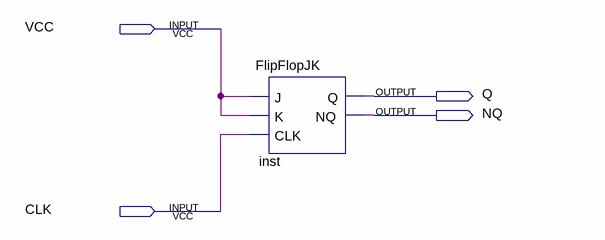
[diagram p0: schematic sheet]
// Quartus schematic Semaforos.bdf as structural Verilog: 1 symbols, 4 pins
module Semaforos (
  input  VCC,
  input  CLK,
  output Q,
  output NQ
);

  FlipFlopJK inst (.J(VCC), .K(VCC), .CLK(CLK), .Q(Q), .NQ(NQ));
endmodule
